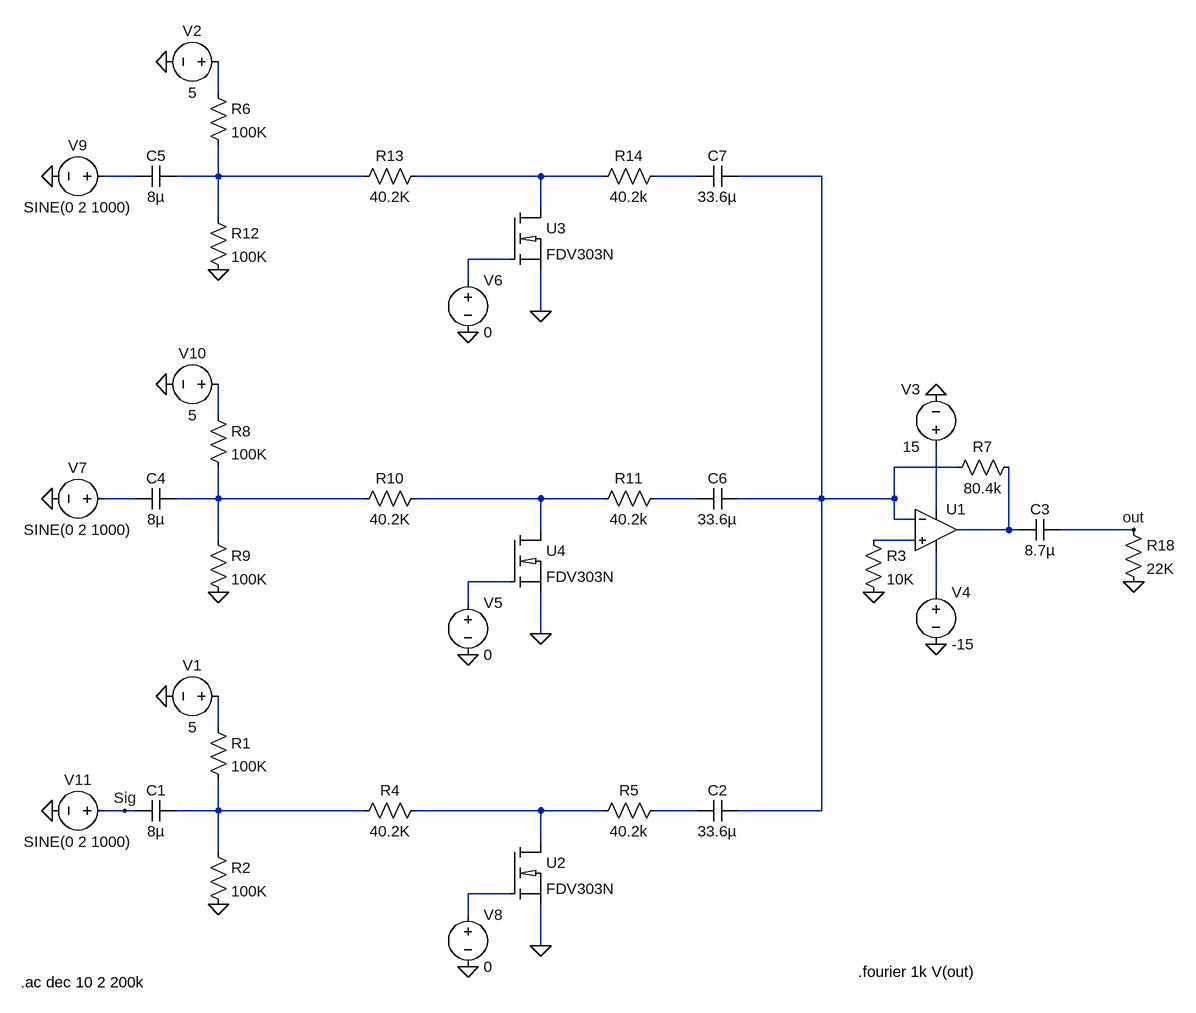
[diagram p0: schematic indgangsvaelger.asc]
indgangsvaelger.asc, the LTspice schematic file:
Version 4
SHEET 1 900 868
WIRE -608 -688 -608 -736
WIRE -736 -560 -784 -560
WIRE -608 -560 -608 -608
WIRE -608 -560 -672 -560
WIRE -384 -560 -608 -560
WIRE -112 -560 -304 -560
WIRE -16 -560 -112 -560
WIRE 128 -560 64 -560
WIRE 320 -560 192 -560
WIRE -112 -512 -112 -560
WIRE -608 -496 -608 -560
WIRE -160 -432 -224 -432
WIRE -224 -400 -224 -432
WIRE -112 -352 -112 -416
WIRE -608 -192 -608 -240
WIRE 528 -112 432 -112
WIRE -736 -64 -784 -64
WIRE -608 -64 -608 -112
WIRE -608 -64 -672 -64
WIRE -384 -64 -608 -64
WIRE -112 -64 -304 -64
WIRE -16 -64 -112 -64
WIRE 128 -64 64 -64
WIRE 320 -64 320 -560
WIRE 320 -64 192 -64
WIRE 432 -64 432 -112
WIRE 432 -64 320 -64
WIRE 496 -48 496 -144
WIRE 432 -32 432 -64
WIRE 464 -32 432 -32
WIRE -112 -16 -112 -64
WIRE 608 -16 608 -112
WIRE 608 -16 528 -16
WIRE 624 -16 608 -16
WIRE 800 -16 688 -16
WIRE -608 0 -608 -64
WIRE 464 0 400 0
WIRE -160 64 -224 64
WIRE 496 80 496 16
WIRE -224 96 -224 64
WIRE -112 144 -112 80
WIRE -608 288 -608 240
WIRE -752 416 -784 416
WIRE -736 416 -752 416
WIRE -608 416 -608 368
WIRE -608 416 -672 416
WIRE -384 416 -608 416
WIRE -112 416 -304 416
WIRE -16 416 -112 416
WIRE 128 416 64 416
WIRE 320 416 320 -64
WIRE 320 416 192 416
WIRE -112 464 -112 416
WIRE -608 480 -608 416
WIRE -160 544 -224 544
WIRE -224 576 -224 544
WIRE -112 624 -112 560
FLAG 496 160 0
FLAG 496 -224 0
FLAG 400 80 0
FLAG -608 80 0
FLAG 800 64 0
FLAG -688 -240 0
FLAG 800 -16 out
FLAG -112 144 0
FLAG -224 176 0
FLAG -864 -64 0
FLAG -608 560 0
FLAG -688 240 0
FLAG -112 624 0
FLAG -224 656 0
FLAG -864 416 0
FLAG -752 416 Sig
FLAG -608 -416 0
FLAG -688 -736 0
FLAG -112 -352 0
FLAG -224 -320 0
FLAG -864 -560 0
SYMBOL cap 128 432 R270
WINDOW 0 32 32 VTop 0
WINDOW 3 0 32 VBottom 0
SYMATTR InstName C2
SYMATTR Value 33.6µ
SYMBOL cap 688 -32 R90
WINDOW 0 0 32 VBottom 0
WINDOW 3 32 32 VTop 0
SYMATTR InstName C3
SYMATTR Value 8.7µ
SYMBOL res 384 -16 R0
SYMATTR InstName R3
SYMATTR Value 10K
SYMBOL res 624 -128 R90
WINDOW 0 0 56 VBottom 0
WINDOW 3 32 56 VTop 0
SYMATTR InstName R7
SYMATTR Value 80.4k
SYMBOL voltage 496 -128 R180
WINDOW 0 24 104 Left 0
WINDOW 3 24 16 Left 0
WINDOW 123 0 0 Left 0
WINDOW 39 0 0 Left 0
SYMATTR InstName V3
SYMATTR Value 15
SYMBOL voltage 496 64 R0
WINDOW 123 0 0 Left 0
WINDOW 39 0 0 Left 0
SYMATTR InstName V4
SYMATTR Value -15
SYMBOL Opamps\\UniversalOpamp2 496 -16 R0
SYMATTR InstName U1
SYMBOL cap -672 -80 R90
WINDOW 0 0 32 VBottom 0
WINDOW 3 32 32 VTop 0
SYMATTR InstName C4
SYMATTR Value 8µ
SYMBOL res -624 -208 R0
SYMATTR InstName R8
SYMATTR Value 100K
SYMBOL res -624 -16 R0
SYMATTR InstName R9
SYMATTR Value 100K
SYMBOL res -288 -80 R90
WINDOW 0 0 56 VBottom 0
WINDOW 3 32 56 VTop 0
SYMATTR InstName R10
SYMATTR Value 40.2K
SYMBOL res 784 -32 R0
SYMATTR InstName R18
SYMATTR Value 22K
SYMBOL voltage -592 -240 R90
WINDOW 0 -32 56 VBottom 0
WINDOW 3 32 56 VTop 0
WINDOW 123 0 0 Left 0
WINDOW 39 0 0 Left 0
SYMATTR InstName V10
SYMATTR Value 5
SYMBOL res 80 -80 R90
WINDOW 0 0 56 VBottom 0
WINDOW 3 32 56 VTop 0
SYMATTR InstName R11
SYMATTR Value 40.2k
SYMBOL voltage -224 80 R0
WINDOW 123 0 0 Left 0
WINDOW 39 0 0 Left 0
SYMATTR InstName V5
SYMATTR Value 0
SYMBOL myLib\\FDV303 -160 -16 R0
SYMATTR InstName U4
SYMBOL voltage -768 -64 R90
WINDOW 0 -32 56 VBottom 0
WINDOW 3 32 56 VTop 0
SYMATTR InstName V7
SYMATTR Value SINE(0 2 1000)
SYMATTR Value2 AC 2
SYMATTR SpiceLine Rser=2.2k
SYMBOL cap -672 400 R90
WINDOW 0 0 32 VBottom 0
WINDOW 3 32 32 VTop 0
SYMATTR InstName C1
SYMATTR Value 8µ
SYMBOL res -624 272 R0
SYMATTR InstName R1
SYMATTR Value 100K
SYMBOL res -624 464 R0
SYMATTR InstName R2
SYMATTR Value 100K
SYMBOL res -288 400 R90
WINDOW 0 0 56 VBottom 0
WINDOW 3 32 56 VTop 0
SYMATTR InstName R4
SYMATTR Value 40.2K
SYMBOL voltage -592 240 R90
WINDOW 0 -32 56 VBottom 0
WINDOW 3 32 56 VTop 0
WINDOW 123 0 0 Left 0
WINDOW 39 0 0 Left 0
SYMATTR InstName V1
SYMATTR Value 5
SYMBOL res 80 400 R90
WINDOW 0 0 56 VBottom 0
WINDOW 3 32 56 VTop 0
SYMATTR InstName R5
SYMATTR Value 40.2k
SYMBOL voltage -224 560 R0
WINDOW 123 0 0 Left 0
WINDOW 39 0 0 Left 0
SYMATTR InstName V8
SYMATTR Value 0
SYMBOL myLib\\FDV303 -160 464 R0
SYMATTR InstName U2
SYMBOL voltage -768 416 R90
WINDOW 0 -32 56 VBottom 0
WINDOW 3 32 56 VTop 0
SYMATTR InstName V11
SYMATTR Value SINE(0 2 1000)
SYMATTR Value2 AC 2
SYMATTR SpiceLine Rser=2.2k
SYMBOL cap 128 -48 R270
WINDOW 0 32 32 VTop 0
WINDOW 3 0 32 VBottom 0
SYMATTR InstName C6
SYMATTR Value 33.6µ
SYMBOL cap -672 -576 R90
WINDOW 0 0 32 VBottom 0
WINDOW 3 32 32 VTop 0
SYMATTR InstName C5
SYMATTR Value 8µ
SYMBOL res -624 -704 R0
SYMATTR InstName R6
SYMATTR Value 100K
SYMBOL res -624 -512 R0
SYMATTR InstName R12
SYMATTR Value 100K
SYMBOL res -288 -576 R90
WINDOW 0 0 56 VBottom 0
WINDOW 3 32 56 VTop 0
SYMATTR InstName R13
SYMATTR Value 40.2K
SYMBOL voltage -592 -736 R90
WINDOW 0 -32 56 VBottom 0
WINDOW 3 32 56 VTop 0
WINDOW 123 0 0 Left 0
WINDOW 39 0 0 Left 0
SYMATTR InstName V2
SYMATTR Value 5
SYMBOL res 80 -576 R90
WINDOW 0 0 56 VBottom 0
WINDOW 3 32 56 VTop 0
SYMATTR InstName R14
SYMATTR Value 40.2k
SYMBOL voltage -224 -416 R0
WINDOW 123 0 0 Left 0
WINDOW 39 0 0 Left 0
SYMATTR InstName V6
SYMATTR Value 0
SYMBOL myLib\\FDV303 -160 -512 R0
SYMATTR InstName U3
SYMBOL voltage -768 -560 R90
WINDOW 0 -32 56 VBottom 0
WINDOW 3 32 56 VTop 0
SYMATTR InstName V9
SYMATTR Value SINE(0 2 1000)
SYMATTR Value2 AC 2
SYMATTR SpiceLine Rser=2.2k
SYMBOL cap 128 -544 R270
WINDOW 0 32 32 VTop 0
WINDOW 3 0 32 VBottom 0
SYMATTR InstName C7
SYMATTR Value 33.6µ
TEXT -912 680 Left 0 !.ac dec 10 2 200k
TEXT 376 664 Left 0 !.fourier 1k V(out)

The netlist it stands for:
* indgangsvaelger.asc
C2 N021 N006 33.6µ
C3 out N014 8.7µ
R3 N015 0 10K
R7 N014 N006 80.4k
V3 N013 0 15
V4 N017 0 -15
XU1 N015 N006 N013 N017 N014 level.2 Avol=1Meg GBW=10Meg Slew=10Meg ilimit=25m rail=0 Vos=0 phimargin=45 en=0 enk=0 in=0 ink=0 Rin=500Meg  ; pins IN+ IN- V+ V- OUT
C4 N010 N009 8µ
R8 N008 N010 100K
R9 N010 0 100K
R10 N011 N010 40.2K
R18 out 0 22K
V10 N008 0 5
R11 N012 N011 40.2k
V5 N016 0 0
XU4 N011 N016 0 FDV303N  ; pins D G S
V7 N009 0 SINE(0 2 1000) AC 2 Rser=2.2k
C1 N019 Sig 8µ
R1 N018 N019 100K
R2 N019 0 100K
R4 N020 N019 40.2K
V1 N018 0 5
R5 N021 N020 40.2k
V8 N022 0 0
XU2 N020 N022 0 FDV303N  ; pins D G S
V11 Sig 0 SINE(0 2 1000) AC 2 Rser=2.2k
C6 N012 N006 33.6µ
C5 N003 N002 8µ
R6 N001 N003 100K
R12 N003 0 100K
R13 N004 N003 40.2K
V2 N001 0 5
R14 N005 N004 40.2k
V6 N007 0 0
XU3 N004 N007 0 FDV303N  ; pins D G S
V9 N002 0 SINE(0 2 1000) AC 2 Rser=2.2k
C7 N005 N006 33.6µ
.ac dec 10 2 200k
.fourier 1k V(out)
.lib UniversalOpamps2.sub
.lib myLib\FDV303N.lib
.backanno
.end